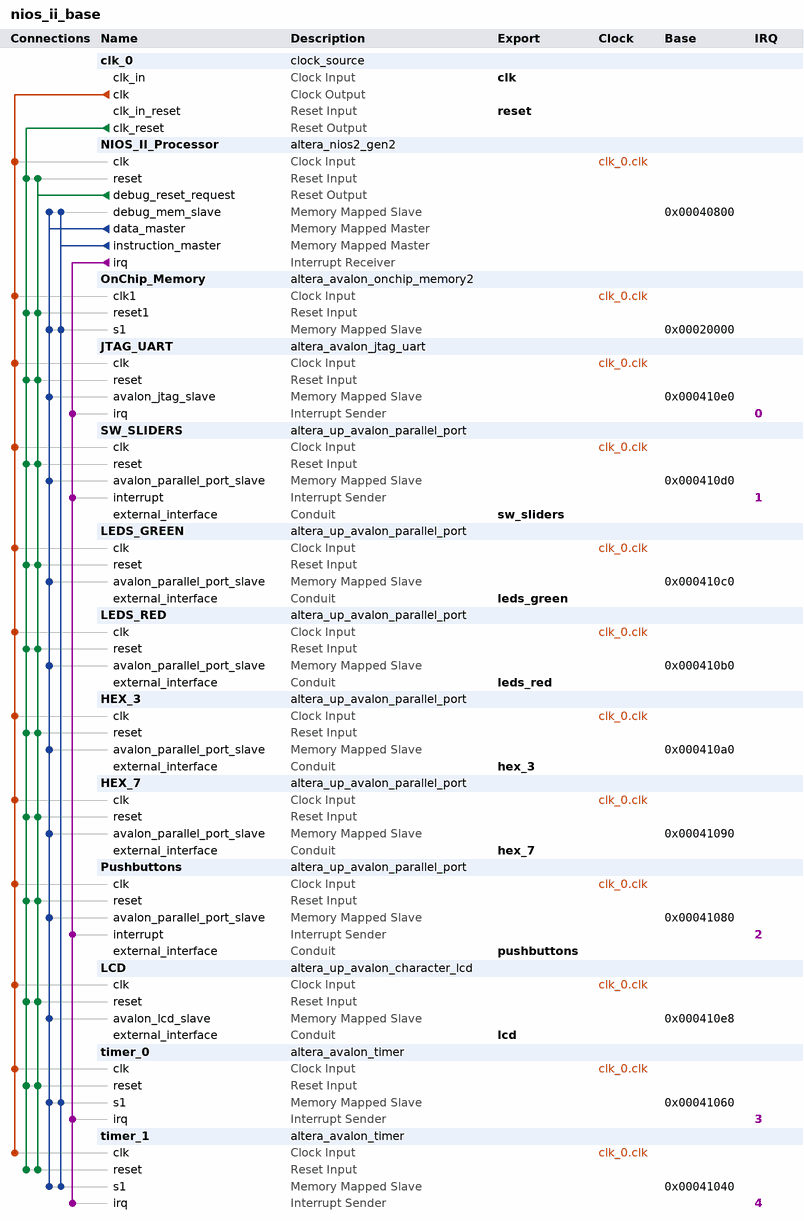
[diagram p0: system contents]
# Platform Designer (Qsys) system nios_ii_base, Cyclone IV GX EP4CGX110CF23C7
# Parameters at their usual value, and those the tool derives, are not listed.
package require -exact qsys 15.1
create_system nios_ii_base
set_project_property DEVICE_FAMILY {Cyclone IV GX}
set_project_property DEVICE EP4CGX110CF23C7

add_instance clk_0 clock_source 16.0
set_instance_parameter_value clk_0 clockFrequency 50000000

add_instance NIOS_II_Processor altera_nios2_gen2 16.0
set_instance_parameter_value NIOS_II_Processor dcache_size 2048
set_instance_parameter_value NIOS_II_Processor exceptionSlave OnChip_Memory.s1
set_instance_parameter_value NIOS_II_Processor icache_size 4096
set_instance_parameter_value NIOS_II_Processor impl Tiny
set_instance_parameter_value NIOS_II_Processor resetSlave OnChip_Memory.s1

add_instance OnChip_Memory altera_avalon_onchip_memory2 16.0
set_instance_parameter_value OnChip_Memory dataWidth 64
set_instance_parameter_value OnChip_Memory dualPort false
set_instance_parameter_value OnChip_Memory initMemContent true
set_instance_parameter_value OnChip_Memory initializationFileName onchip_mem.hex
set_instance_parameter_value OnChip_Memory memorySize 128000

add_instance JTAG_UART altera_avalon_jtag_uart 16.0
set_instance_parameter_value JTAG_UART simInteractiveOptions NO_INTERACTIVE_WINDOWS

add_instance SW_SLIDERS altera_up_avalon_parallel_port 15.1
set_instance_parameter_value SW_SLIDERS board DE2i-150
set_instance_parameter_value SW_SLIDERS capture true
set_instance_parameter_value SW_SLIDERS edge Rising
set_instance_parameter_value SW_SLIDERS irq true
set_instance_parameter_value SW_SLIDERS preset {Slider Switches}

add_instance LEDS_GREEN altera_up_avalon_parallel_port 15.1
set_instance_parameter_value LEDS_GREEN board DE2i-150
set_instance_parameter_value LEDS_GREEN capture false
set_instance_parameter_value LEDS_GREEN edge Rising
set_instance_parameter_value LEDS_GREEN irq false
set_instance_parameter_value LEDS_GREEN preset LEDs

add_instance LEDS_RED altera_up_avalon_parallel_port 15.1
set_instance_parameter_value LEDS_RED board DE2i-150
set_instance_parameter_value LEDS_RED capture false
set_instance_parameter_value LEDS_RED edge Rising
set_instance_parameter_value LEDS_RED irq false
set_instance_parameter_value LEDS_RED leds Red
set_instance_parameter_value LEDS_RED preset LEDs

add_instance HEX_3 altera_up_avalon_parallel_port 15.1
set_instance_parameter_value HEX_3 board DE2i-150
set_instance_parameter_value HEX_3 capture false
set_instance_parameter_value HEX_3 edge Rising
set_instance_parameter_value HEX_3 irq false
set_instance_parameter_value HEX_3 preset {Seven Segment Displays}

add_instance HEX_7 altera_up_avalon_parallel_port 15.1
set_instance_parameter_value HEX_7 board DE2i-150
set_instance_parameter_value HEX_7 capture false
set_instance_parameter_value HEX_7 edge Rising
set_instance_parameter_value HEX_7 irq false
set_instance_parameter_value HEX_7 preset {Seven Segment Displays}
set_instance_parameter_value HEX_7 sevensegs {7 to 4}

add_instance Pushbuttons altera_up_avalon_parallel_port 15.1
set_instance_parameter_value Pushbuttons board DE2i-150
set_instance_parameter_value Pushbuttons capture true
set_instance_parameter_value Pushbuttons edge Rising
set_instance_parameter_value Pushbuttons irq true
set_instance_parameter_value Pushbuttons preset Pushbuttons

add_instance LCD altera_up_avalon_character_lcd 15.1
set_instance_parameter_value LCD cursor Normal

add_instance timer_0 altera_avalon_timer 16.0
set_instance_parameter_value timer_0 period 1
set_instance_parameter_value timer_0 periodUnits MSEC

add_instance timer_1 altera_avalon_timer 16.0
set_instance_parameter_value timer_1 period 1
set_instance_parameter_value timer_1 periodUnits MSEC

# connections
add_connection clk_0.clk HEX_3.clk clock
add_connection clk_0.clk HEX_7.clk clock
add_connection clk_0.clk JTAG_UART.clk clock
add_connection clk_0.clk LCD.clk clock
add_connection clk_0.clk LEDS_GREEN.clk clock
add_connection clk_0.clk LEDS_RED.clk clock
add_connection clk_0.clk NIOS_II_Processor.clk clock
add_connection clk_0.clk OnChip_Memory.clk1 clock
add_connection clk_0.clk Pushbuttons.clk clock
add_connection clk_0.clk SW_SLIDERS.clk clock
add_connection clk_0.clk timer_0.clk clock
add_connection clk_0.clk timer_1.clk clock
add_connection clk_0.clk_reset HEX_3.reset reset
add_connection clk_0.clk_reset HEX_7.reset reset
add_connection clk_0.clk_reset JTAG_UART.reset reset
add_connection clk_0.clk_reset LCD.reset reset
add_connection clk_0.clk_reset LEDS_GREEN.reset reset
add_connection clk_0.clk_reset LEDS_RED.reset reset
add_connection clk_0.clk_reset NIOS_II_Processor.reset reset
add_connection clk_0.clk_reset OnChip_Memory.reset1 reset
add_connection clk_0.clk_reset Pushbuttons.reset reset
add_connection clk_0.clk_reset SW_SLIDERS.reset reset
add_connection clk_0.clk_reset timer_0.reset reset
add_connection clk_0.clk_reset timer_1.reset reset
add_connection NIOS_II_Processor.debug_reset_request HEX_3.reset reset
add_connection NIOS_II_Processor.debug_reset_request HEX_7.reset reset
add_connection NIOS_II_Processor.debug_reset_request JTAG_UART.reset reset
add_connection NIOS_II_Processor.debug_reset_request LCD.reset reset
add_connection NIOS_II_Processor.debug_reset_request LEDS_GREEN.reset reset
add_connection NIOS_II_Processor.debug_reset_request LEDS_RED.reset reset
add_connection NIOS_II_Processor.debug_reset_request NIOS_II_Processor.reset reset
add_connection NIOS_II_Processor.debug_reset_request OnChip_Memory.reset1 reset
add_connection NIOS_II_Processor.debug_reset_request Pushbuttons.reset reset
add_connection NIOS_II_Processor.debug_reset_request SW_SLIDERS.reset reset
add_connection NIOS_II_Processor.debug_reset_request timer_0.reset reset
add_connection NIOS_II_Processor.debug_reset_request timer_1.reset reset
add_connection NIOS_II_Processor.data_master HEX_3.avalon_parallel_port_slave avalon
set_connection_parameter_value NIOS_II_Processor.data_master/HEX_3.avalon_parallel_port_slave baseAddress 0x000410a0
add_connection NIOS_II_Processor.data_master HEX_7.avalon_parallel_port_slave avalon
set_connection_parameter_value NIOS_II_Processor.data_master/HEX_7.avalon_parallel_port_slave baseAddress 0x00041090
add_connection NIOS_II_Processor.data_master JTAG_UART.avalon_jtag_slave avalon
set_connection_parameter_value NIOS_II_Processor.data_master/JTAG_UART.avalon_jtag_slave baseAddress 0x000410e0
add_connection NIOS_II_Processor.data_master LCD.avalon_lcd_slave avalon
set_connection_parameter_value NIOS_II_Processor.data_master/LCD.avalon_lcd_slave baseAddress 0x000410e8
add_connection NIOS_II_Processor.data_master LEDS_GREEN.avalon_parallel_port_slave avalon
set_connection_parameter_value NIOS_II_Processor.data_master/LEDS_GREEN.avalon_parallel_port_slave baseAddress 0x000410c0
add_connection NIOS_II_Processor.data_master LEDS_RED.avalon_parallel_port_slave avalon
set_connection_parameter_value NIOS_II_Processor.data_master/LEDS_RED.avalon_parallel_port_slave baseAddress 0x000410b0
add_connection NIOS_II_Processor.data_master NIOS_II_Processor.debug_mem_slave avalon
set_connection_parameter_value NIOS_II_Processor.data_master/NIOS_II_Processor.debug_mem_slave baseAddress 0x00040800
add_connection NIOS_II_Processor.data_master OnChip_Memory.s1 avalon
set_connection_parameter_value NIOS_II_Processor.data_master/OnChip_Memory.s1 baseAddress 0x00020000
add_connection NIOS_II_Processor.data_master Pushbuttons.avalon_parallel_port_slave avalon
set_connection_parameter_value NIOS_II_Processor.data_master/Pushbuttons.avalon_parallel_port_slave baseAddress 0x00041080
add_connection NIOS_II_Processor.data_master SW_SLIDERS.avalon_parallel_port_slave avalon
set_connection_parameter_value NIOS_II_Processor.data_master/SW_SLIDERS.avalon_parallel_port_slave baseAddress 0x000410d0
add_connection NIOS_II_Processor.data_master timer_0.s1 avalon
set_connection_parameter_value NIOS_II_Processor.data_master/timer_0.s1 baseAddress 0x00041060
add_connection NIOS_II_Processor.data_master timer_1.s1 avalon
set_connection_parameter_value NIOS_II_Processor.data_master/timer_1.s1 baseAddress 0x00041040
add_connection NIOS_II_Processor.instruction_master NIOS_II_Processor.debug_mem_slave avalon
set_connection_parameter_value NIOS_II_Processor.instruction_master/NIOS_II_Processor.debug_mem_slave baseAddress 0x00040800
add_connection NIOS_II_Processor.instruction_master OnChip_Memory.s1 avalon
set_connection_parameter_value NIOS_II_Processor.instruction_master/OnChip_Memory.s1 baseAddress 0x00020000
add_connection NIOS_II_Processor.instruction_master timer_0.s1 avalon
set_connection_parameter_value NIOS_II_Processor.instruction_master/timer_0.s1 baseAddress 0x00041060
add_connection NIOS_II_Processor.instruction_master timer_1.s1 avalon
set_connection_parameter_value NIOS_II_Processor.instruction_master/timer_1.s1 baseAddress 0x00041040
add_connection NIOS_II_Processor.irq JTAG_UART.irq interrupt
set_connection_parameter_value NIOS_II_Processor.irq/JTAG_UART.irq irqNumber 0
add_connection NIOS_II_Processor.irq Pushbuttons.interrupt interrupt
set_connection_parameter_value NIOS_II_Processor.irq/Pushbuttons.interrupt irqNumber 2
add_connection NIOS_II_Processor.irq SW_SLIDERS.interrupt interrupt
set_connection_parameter_value NIOS_II_Processor.irq/SW_SLIDERS.interrupt irqNumber 1
add_connection NIOS_II_Processor.irq timer_0.irq interrupt
set_connection_parameter_value NIOS_II_Processor.irq/timer_0.irq irqNumber 3
add_connection NIOS_II_Processor.irq timer_1.irq interrupt
set_connection_parameter_value NIOS_II_Processor.irq/timer_1.irq irqNumber 4

# exported interfaces
add_interface clk clock sink
set_interface_property clk EXPORT_OF clk_0.clk_in
add_interface hex_3 conduit end
set_interface_property hex_3 EXPORT_OF HEX_3.external_interface
add_interface hex_7 conduit end
set_interface_property hex_7 EXPORT_OF HEX_7.external_interface
add_interface lcd conduit end
set_interface_property lcd EXPORT_OF LCD.external_interface
add_interface leds_green conduit end
set_interface_property leds_green EXPORT_OF LEDS_GREEN.external_interface
add_interface leds_red conduit end
set_interface_property leds_red EXPORT_OF LEDS_RED.external_interface
add_interface pushbuttons conduit end
set_interface_property pushbuttons EXPORT_OF Pushbuttons.external_interface
add_interface reset reset sink
set_interface_property reset EXPORT_OF clk_0.clk_in_reset
add_interface sw_sliders conduit end
set_interface_property sw_sliders EXPORT_OF SW_SLIDERS.external_interface

set_interconnect_requirement {$system} qsys_mm.clockCrossingAdapter HANDSHAKE
set_interconnect_requirement {$system} qsys_mm.enableEccProtection FALSE
set_interconnect_requirement {$system} qsys_mm.insertDefaultSlave FALSE
set_interconnect_requirement {$system} qsys_mm.maxAdditionalLatency 1

save_system nios_ii_base.qsys
